# Altium schematic sheet Power_Charging.SchDoc: Power
size A; Revision: 1.0; SheetNumber: 3; SheetTotal: 6
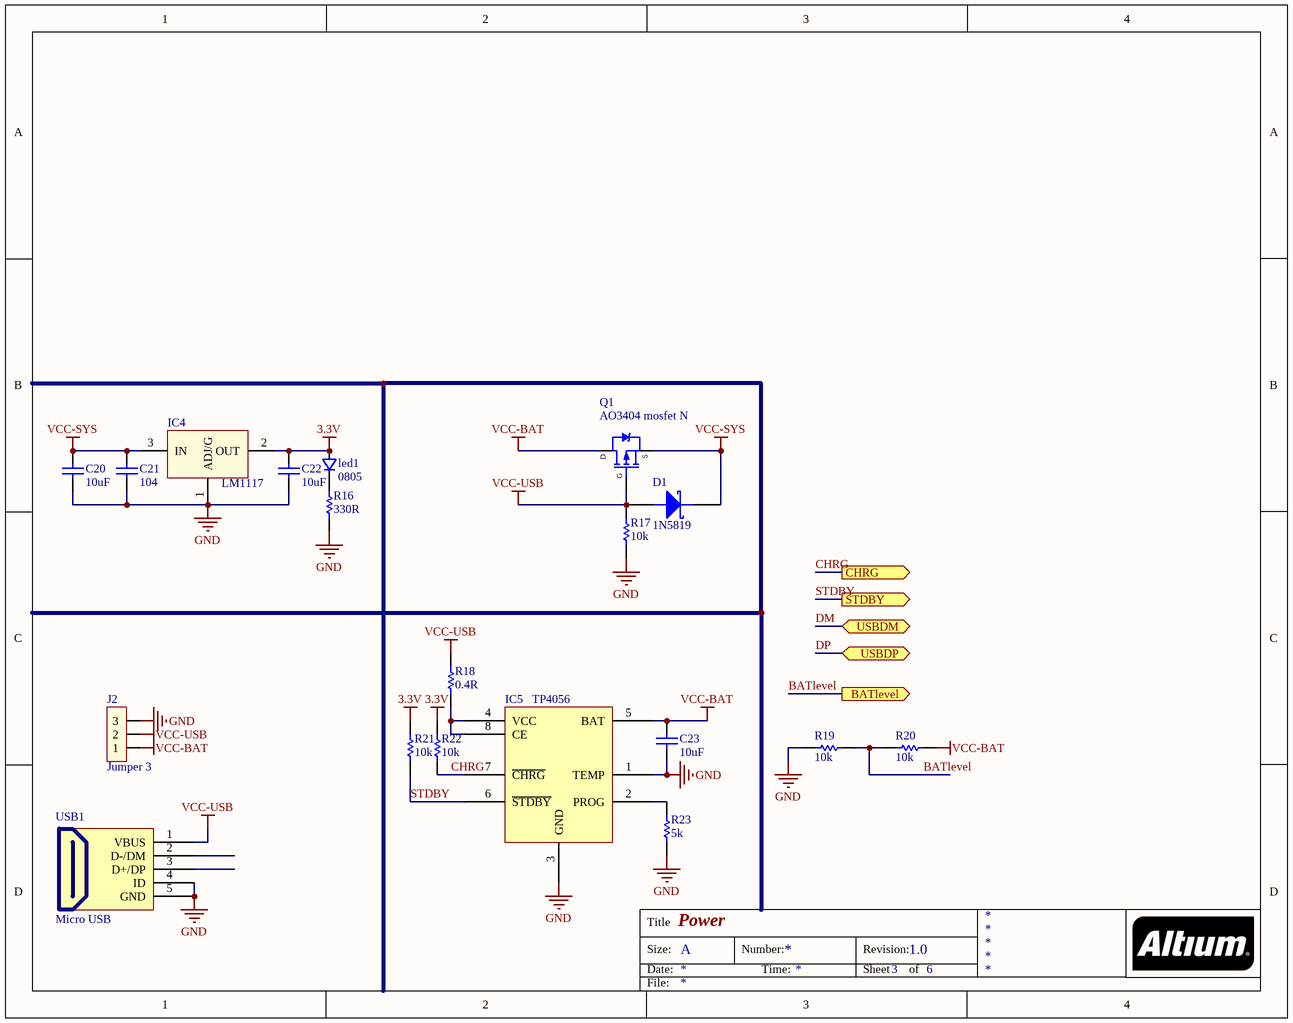
[diagram p0: Power_Charging.SchDoc]

## Parts
C20  10uF  [Cap 0805]
C21  104  [Cap 0805]
C22  10uF  [Cap 0805]
C23  10uF  [Cap 0805]
D1  1N5819  [1N5819_SMD]
IC4  LM1117  [SOT223-4N]
IC5  TP4056  [SOP-8]
J2  Jumper 3  [jp3]
led1  0805  [0805]
Q1  AO3404 mosfet N  [SOT23-3]
R16  330R  [RES 0805]
R17  10k  [RES 0805]
R18  0.4R  [RES_2512]
R19  10k  [RES 0805]
R20  10k  [RES 0805]
R21  10k  [RES 0805]
R22  10k  [RES 0805]
R23  5k  [RES 0805]
USB1  Micro USB  [Micro USB]

## Ports
BATlevel (out), CHRG (out), STDBY (out), USBDM, USBDP

## Nets
3.3V: C22.2 IC4.2(OUT) led1.1 R21.2 R22.2
GND: C20.1 C21.1 C22.1 C23.1 IC4.1(ADJ/G) IC5.1(TEMP) IC5.3(GND) J2.3 R16.2 R17.1 R19.2 R23.1 USB1.4(ID) USB1.5(GND)
VCC-BAT: C23.2 IC5.5(BAT) J2.1 Q1.3(D) R20.1
VCC-SYS: C20.2 C21.2 D1.2(K) IC4.3(IN) Q1.2(S)
VCC-USB: D1.1(A) J2.2 Q1.1(G) R17.2 R18.2 USB1.1(VBUS)
BATlevel: R19.1 R20.2 ; port BATlevel
CHRG: IC5.7(~{CHRG}) R22.1 ; port CHRG
DM: port USBDM
DP: port USBDP
STDBY: IC5.6(~{STDBY}) R21.1 ; port STDBY
NetIC5_2: IC5.2(PROG) R23.2
NetIC5_4: IC5.4(VCC) IC5.8(CE) R18.1
Netled1_2: led1.2 R16.1

Not connected (* = marked no-connect by the designer): USB1 2(D-/DM) 3(D+/DP)

## Notes on the sheet
- Title
- Size:
- Date:
- A
- Number:
- Time:
- Revision:
- Sheet
- of
- File:

## Library data of the parts
C20-C23 = Cap_0805
D1 = SS14_1N5819_SMD: 1N5819 diode schottky
IC4 = LM1117: Available in 1.8V, 2.5V, 2.85V, 3.3V, 5V, and  Adjustable Versions; Value: LM317
IC5 = TP4056: Lithium Batterry charger IC
J2 = JP3: Value: J3
led1 = led_dan
Q1 = AO3405_mosfet: AO3404 mosfet N sot23-3
R16 R17 R19-R23 = Res_0805: resistor smd0805
R18 = res_2512
USB1 = MicroUSB